# Altium schematic sheet Actuadores.SchDoc
size A4
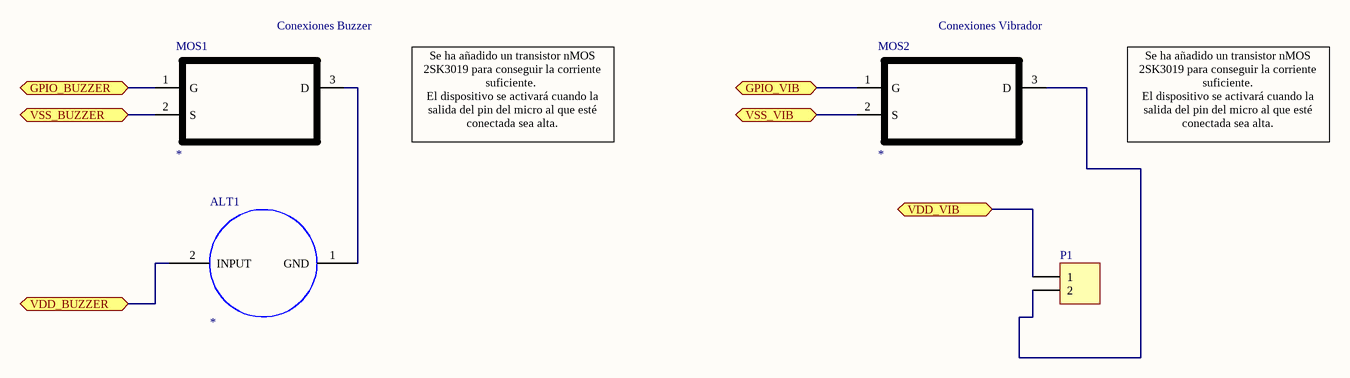
[diagram p0: Actuadores.SchDoc]

## Parts
ALT1  *  [Buzzer]
MOS1  *  [SOT-523]
MOS2  *  [SOT-523]
P1  (no value)  [HDR1X2]

## Ports
GPIO_BUZZER, GPIO_VIB, VDD_BUZZER, VDD_VIB, VSS_BUZZER, VSS_VIB

## Nets
GPIO_BUZZER: MOS1.1(G) ; port GPIO_BUZZER
GPIO_VIB: MOS2.1(G) ; port GPIO_VIB
VDD_BUZZER: ALT1.2(INPUT) ; port VDD_BUZZER
VDD_VIB: P1.1 ; port VDD_VIB
VSS_BUZZER: MOS1.2(S) ; port VSS_BUZZER
VSS_VIB: MOS2.2(S) ; port VSS_VIB
NetALT1_1: ALT1.1(GND) MOS1.3(D)
NetMOS2_3: MOS2.3(D) P1.2

## Notes on the sheet
- Conexiones Buzzer
- Conexiones Vibrador
- Se ha añadido un transistor nMOS 2SK3019 para conseguir la corriente suficiente.
  El dispositivo se activará cuando la salida del pin del micro al que esté conectada sea alta.

## Library data of the parts
ALT1 = ABT-407
MOS1 MOS2 = MOSFETN
P1 = Header 2: Header, 2-Pin; LatestRevisionDate: 17-Jul-2002; LatestRevisionNote: Re-released for DXP Platform.; Publisher: Altium Limited